# EAGLE schematic audio_dac (EAGLE 8.4.3)
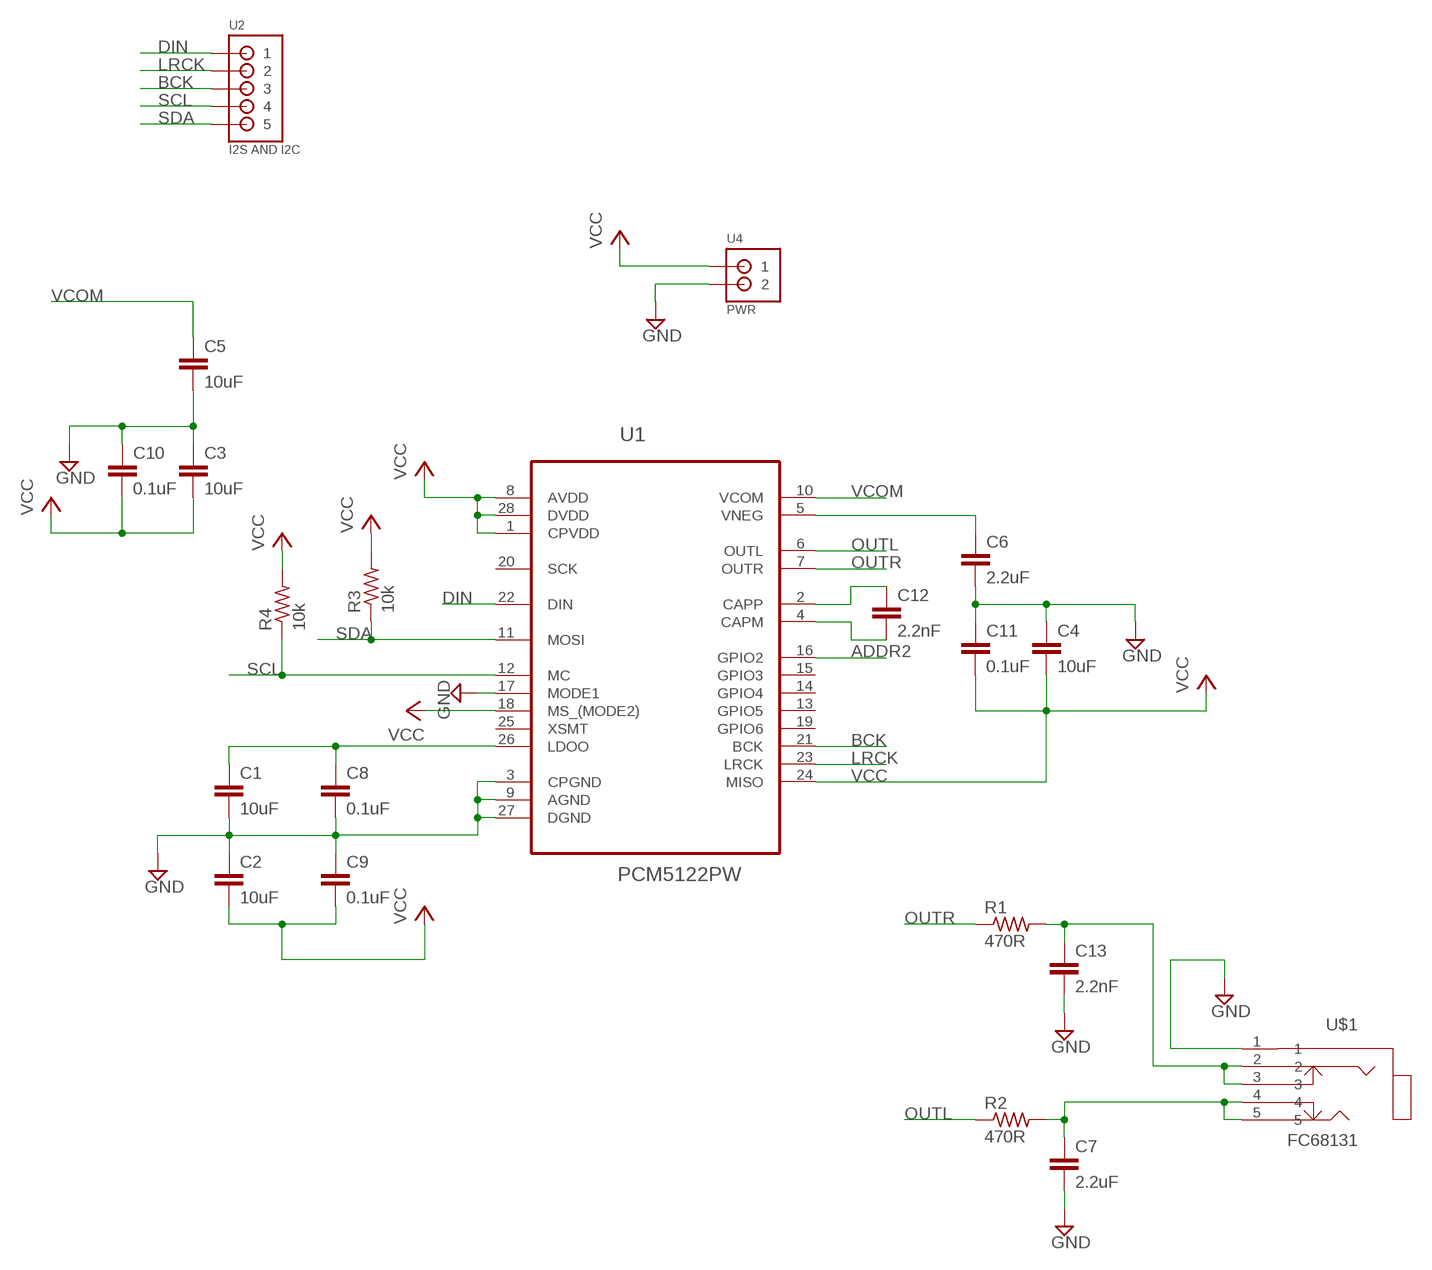
[diagram p0: schematic, sheet 1]

## Parts
C1  10uF  C-EUC0805  [C0805]
C2  10uF  C-EUC0805  [C0805]
C3  10uF  C-EUC0805  [C0805]
C4  10uF  C-EUC0805  [C0805]
C5  10uF  C-EUC0805  [C0805]
C6  2.2uF  C-EUC0805  [C0805]
C7  2.2uF  C-EUC0603  [C0603]
C8  0.1uF  C-EUC0805  [C0805]
C9  0.1uF  C-EUC0805  [C0805]
C10  0.1uF  C-EUC0805  [C0805]
C11  0.1uF  C-EUC0805  [C0805]
C12  2.2nF  C-EUC0805  [C0805]
C13  2.2nF  C-EUC0603  [C0603]
R1  470R  R-US_R0805  [R0805]
R2  470R  R-US_R0805  [R0805]
R3  10k  R-US_R0805  [R0805]
R4  10k  R-US_R0805  [R0805]
U1  PCM5122PW  [SOP65P640X120-28N]
U2  I2S AND I2C  JST-PH_5-PIN_HEADER  [JST_B5B-PH_HEADER]
U4  PWR  JST-PH_2-PIN_HEADER  [JST_B2B-PH_HEADER]
U$1  FC68131  [FC68131-5P]

## Nets
3.3V: C2.2 C9.2 ; supply symbol labelled VCC
ADDR2: U1.16(GPIO2)
BCK: U1.21(BCK) U2.P3
DIN: U1.22(DIN) U2.P1
GND: C1.2 C2.1 C3.1 C4.1 C5.2 C6.2 C7.2 C8.2 C9.1 C10.1 C11.1 C13.2 U1.3(CPGND) U1.9(AGND) U1.17(MODE1) U1.27(DGND) U4.P2 U$1.1
LRCK: U1.23(LRCK) U2.P2
N$1: C1.1 C8.1 U1.26(LDOO)
N$2: C12.2 U1.4(CAPM)
N$3: C6.1 U1.5(VNEG)
N$6: C12.1 U1.2(CAPP)
N$7: C13.1 R1.2 U$1.2 U$1.3
N$8: C7.1 R2.2 U$1.4 U$1.5
OUTL: R2.1 U1.6(OUTL)
OUTR: R1.1 U1.7(OUTR)
SCL: R4.1 U1.12(MC) U2.P4
SDA: R3.1 U1.11(MOSI) U2.P5
VCC: C3.2 C4.2 C10.2 C11.2 R3.2 R4.2 U1.1(CPVDD) U1.8(AVDD) U1.18(MS_(MODE2)) U1.24(MISO) U1.28(DVDD) U4.P1
VCOM: C5.1 U1.10(VCOM)
Unconnected: U1.13(GPIO5) U1.14(GPIO4) U1.15(GPIO3) U1.19(GPIO6) U1.20(SCK) U1.25(XSMT)

## Library data of the parts
C1-C13 = rcl:C-EU: CAPACITOR, European symbol
R1-R4 = adafruit:R-US_: RESISTOR, American symbol
U1 = pcm5122:PCM5122PW: Audio Stereo DAC with 32-bit, 384kHz PCM Interface,TSSOP-28; MPN: PCM5122PW; OC_FARNELL: 2307931; OC_NEWARK: 55W7071; PACKAGE: TSSOP-28; SUPPLIER: TEXAS INSTRUMENTS
U2 = SRG:JST-PH_5-PIN_HEADER: 5-pin JST PH Shrouded Header, top entry P/N B5B-PH-K-S Mating connector PHR-5 Mating cable assembly: Sparkfun PRT-09917 <http://www.sparkfun.com/products/9917>
U4 = SRG:JST-PH_2-PIN_HEADER: 2-pin JST PH Shrouded Header, top entry P/N B2B-PH-K-S Mating connector PHR-2 Mating cable assembly: Sparkfun PRT-09914 <http://www.sparkfun.com/products/9914>
U$1 = con-cliff:FC68131

## Net classes
0 default: width 0.406 mm